# Altium schematic sheet 04-IO.SchDoc
size A
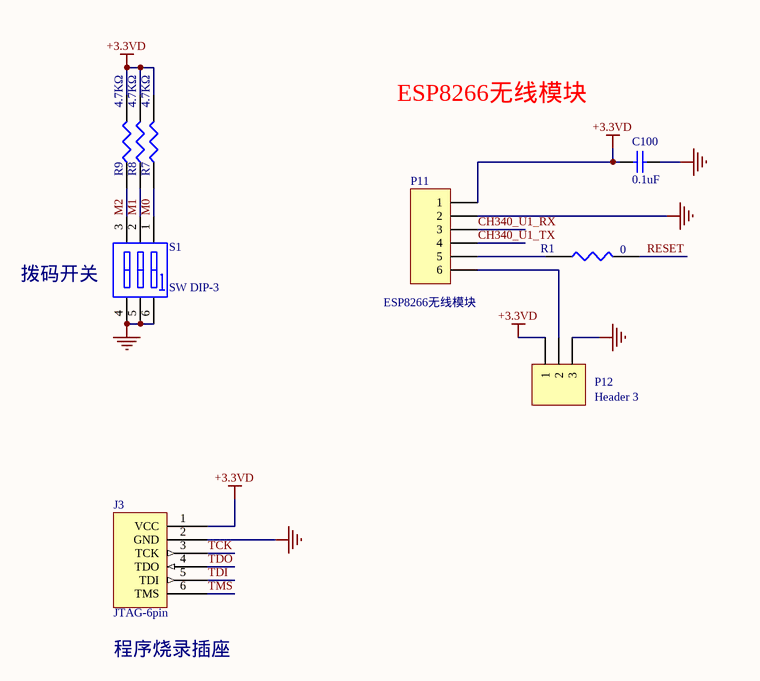
[diagram p0: 04-IO.SchDoc]

## Parts
C100  0.1uF  [0402]
J3  JTAG-6pin  [SIP6]
P11  ESP8266无线模块  [ATK-ESP8266]
P12  Header 3  [HDR1X3]
R1  0  [0805]
R7  4.7KΩ  [0805]
R8  4.7KΩ  [0805]
R9  4.7KΩ  [0805]
S1  SW DIP-3  [SW3 SMD]

## Nets
+3.3VD: C100.1 J3.1(VCC) P11.1 P12.1 R7.2 R8.2 R9.2
DGND: C100.2 J3.2(GND) P11.2 P12.3 S1.4(B3) S1.5(B2) S1.6(B1)
CH340_U1_RX: P11.3
CH340_U1_TX: P11.4
M0: R7.1 S1.1(A1)
M1: R8.1 S1.2(A2)
M2: R9.1 S1.3(A3)
RESET: R1.2
TCK: J3.3(TCK)
TDI: J3.5(TDI)
TDO: J3.4(TDO)
TMS: J3.6(TMS)
NetP11_5: P11.5 R1.1
NetP11_6: P11.6 P12.2

## Notes on the sheet
- ESP8266无线模块
- 拨码开关
- (near J3) 程序烧录插座

## Library data of the parts
C100 = Cap: Capacitor; Value: 100pF; Published: 8-Jun-2000; LatestRevisionDate: 17-Jul-2002; LatestRevisionNote: Re-released for DXP Platform.; PackageReference: RAD-0.3; Publisher: Altium Limited
J3 = JTAG: JTAG INTERFACE
P11 = Header 6: Header, 6-Pin; LatestRevisionDate: 17-Jul-2002; LatestRevisionNote: Re-released for DXP Platform.; Publisher: Altium Limited
P12 = Header 3: Header, 3-Pin; LatestRevisionDate: 17-Jul-2002; LatestRevisionNote: Re-released for DXP Platform.; Publisher: Altium Limited
R1 R7-R9 = RES1
S1 = SW DIP-3: DIP Switch